# Altium project Teeny.PrjPcb
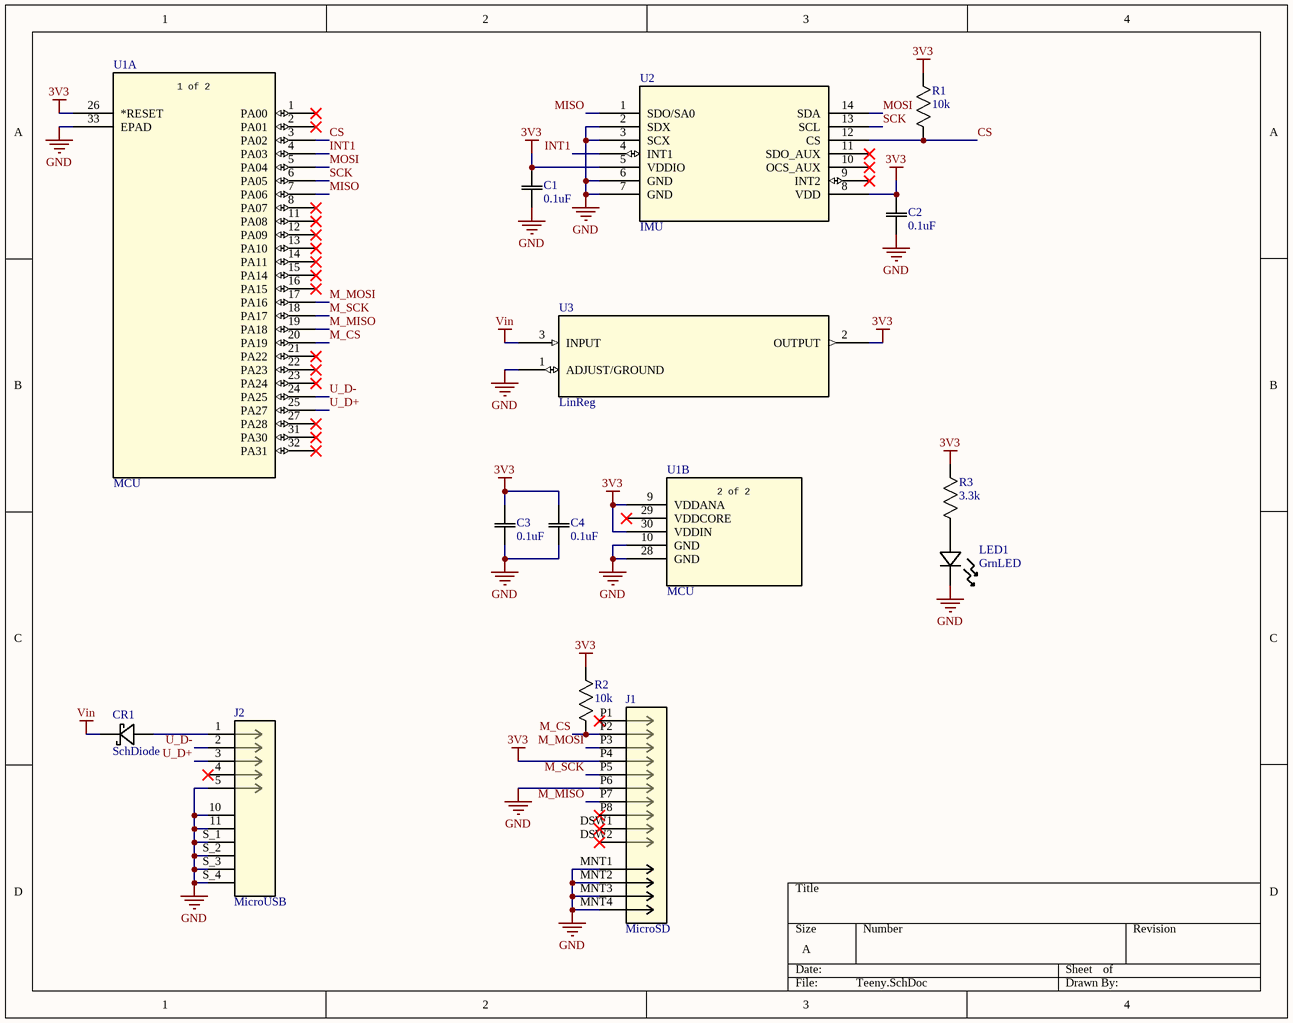
[diagram p0: Teeny.SchDoc]
1 sheet, 14 parts. Net scope: global (net labels, ports and power ports of the same name join across sheets).
Board file: Teeny.PcbDoc

## Sheet Teeny.SchDoc
size A; SheetNumber: 1; SheetTotal: 1

### Parts
C1  0.1uF  [0.1uF/16V]
C2  0.1uF  [0.1uF/16V]
C3  0.1uF  [0.1uF/16V]
C4  0.1uF  [0.1uF/16V]
CR1  SchDiode  [SchDiode]
J1  MicroSD  [MicroSD]
J2  MicroUSB  [MicroUSB]
LED1  GrnLED  [GreenLED]
R1  10k  [10k/0.05W]
R2  10k  [10k/0.05W]
R3  3.3k  [3.3k/0.1W]
U1  MCU  [MCU]  (parts A,B of 2)
U2  IMU  [IMU]
U3  LinReg  [LinReg]

### Nets
3V3: C1.2 C2.2 C3.2 C4.2 J1.P4(VDD) R1.2 R2.2 R3.1 U1.9(VDDANA) U1.26(*RESET) U1.30(VDDIN) U2.5(VDDIO) U2.8(VDD) U3.2(OUTPUT)
GND: C1.1 C2.1 C3.1 C4.1 J1.MNT1(Mount) J1.MNT2(Mount) J1.MNT3(Mount) J1.MNT4(Mount) J1.P6(VSS) J2.5 J2.10 J2.11 J2.S_1 J2.S_2 J2.S_3 J2.S_4 LED1.1 U1.10(GND) U1.28(GND) U1.33(EPAD) U2.2(SDX) U2.3(SCX) U2.6(GND) U2.7(GND) U3.1(ADJUST/GROUND)
Vin: CR1.1 U3.3(INPUT)
CS: R1.1 U1.3(PA02) U2.12(CS)
INT1: U1.4(PA03) U2.4(INT1)
M_CS: J1.P2(CD/DAT3) R2.1 U1.20(PA19)
M_MISO: J1.P7(DAT0) U1.19(PA18)
M_MOSI: J1.P3(CMD) U1.17(PA16)
M_SCK: J1.P5(CLK) U1.18(PA17)
MISO: U1.7(PA06) U2.1(SDO/SA0)
MOSI: U1.5(PA04) U2.14(SDA)
SCK: U1.6(PA05) U2.13(SCL)
U_D+: J2.3 U1.25(PA27)
U_D-: J2.2 U1.24(PA25)
NetCR1_2: CR1.2 J2.1
NetLED1_2: LED1.2 R3.2

Not connected (* = marked no-connect by the designer): J1 DSW1(LEVER)* DSW2(SWITCH)* P1(DAT2)* P8(DAT1)*; J2 4*; U1 1(PA00)* 2(PA01)* 8(PA07)* 11(PA08)* 12(PA09)* 13(PA10)* 14(PA11)* 15(PA14)* 16(PA15)* 21(PA22)* 22(PA23)* 23(PA24)* 27(PA28)* 29(VDDCORE)* 31(PA30)* 32(PA31)*; U2 9(INT2)* 10(OCS_AUX)* 11(SDO_AUX)*

### Notes on the sheet
- (in symbol MCU, part A) 1 of 2
- (in symbol MCU, part B) 2 of 2

### Library data of the parts
C1-C4 = 0.1uF/16V: GRM155R71C104KA88D; Manufacturer_Name: Murata; Copyright: Copyright (C) 2026 Ultra Librarian. All rights reserved.; Manufacturer_Part_Number: GRM155R71C104KA88D
CR1 = Schottky Diode: B5819W-TP; Manufacturer_Name: MCC; Copyright: Copyright (C) 2025 Ultra Librarian. All rights reserved.; Manufacturer_Part_Number: B5819W-TP
J1 = MicroSD: MEM2080-00-128-00-A; Manufacturer_Name: Global Connector Technology; Copyright: Copyright (C) 2025 Ultra Librarian. All rights reserved.; Manufacturer_Part_Number: MEM2080-00-128-00-A; RefDes: RefDes; Type: Type
J2 = MicroUSB: 10118194-0001LF; Manufacturer_Name: Amphenol ICC; Copyright: Copyright (C) 2026 Ultra Librarian. All rights reserved.; Manufacturer_Part_Number: 10118194-0001LF; RefDes: RefDes; Type: Type
LED1 = GreenLED: LTST-C190KGKT; Manufacturer_Name: LITE-ON; Copyright: Copyright (C) 2025 Ultra Librarian. All rights reserved.; Manufacturer_Part_Number: LTST-C190KGKT
R1 R2 = 10k/0.05W: RC0201FR-0710KL; Manufacturer_Name: Yageo; Copyright: Copyright (C) 2025 Ultra Librarian. All rights reserved.; Manufacturer_Part_Number: RC0201FR-0710KL
R3 = 3.3k/0.1W: RC0603FR-073K3L; Manufacturer_Name: Yageo; Copyright: Copyright (C) 2025 Ultra Librarian. All rights reserved.; Manufacturer_Part_Number: RC0603FR-073K3L
U1 = MCU: ATSAMD21E18A-MUT; Manufacturer_Name: Microchip; Copyright: Copyright (C) 2026 Ultra Librarian. All rights reserved.; Manufacturer_Part_Number: ATSAMD21E18A-MUT; RefDes: RefDes; Type: Type
U2 = IMU: LSM6DSRXTR; Manufacturer_Name: STMicroelectronics; Copyright: Copyright (C) 2025 Ultra Librarian. All rights reserved.; Manufacturer_Part_Number: LSM6DSRXTR; RefDes: RefDes; Type: Type
U3 = LinReg: NCP1117ST33T3G; Manufacturer_Name: onsemi; Copyright: Copyright (C) 2026 Ultra Librarian. All rights reserved.; Manufacturer_Part_Number: NCP1117ST33T3G; RefDes: RefDes; Type: Type